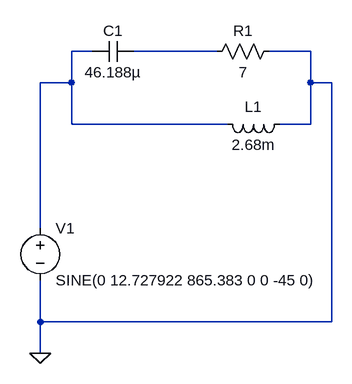
[diagram p0: schematic scheme9.asc]
scheme9.asc, the LTspice schematic file:
Version 4
SHEET 1 880 680
WIRE 256 -96 224 -96
WIRE 448 -96 320 -96
WIRE 592 -96 528 -96
WIRE 224 -48 224 -96
WIRE 224 -48 176 -48
WIRE 592 -48 592 -96
WIRE 624 -48 592 -48
WIRE 224 16 224 -48
WIRE 464 16 224 16
WIRE 592 16 592 -48
WIRE 592 16 544 16
WIRE 176 176 176 -48
WIRE 176 320 176 256
WIRE 624 320 624 -48
WIRE 624 320 176 320
WIRE 176 368 176 320
FLAG 176 368 0
SYMBOL voltage 176 160 R0
WINDOW 123 0 0 Left 0
WINDOW 39 0 0 Left 0
SYMATTR InstName V1
SYMATTR Value SINE(0 12.727922 865.383 0 0 -45 0)
SYMBOL ind 560 0 R90
WINDOW 0 5 56 VBottom 2
WINDOW 3 32 56 VTop 2
SYMATTR InstName L1
SYMATTR Value 2.68m
SYMBOL cap 320 -112 R90
WINDOW 0 0 32 VBottom 2
WINDOW 3 32 32 VTop 2
SYMATTR InstName C1
SYMATTR Value 46.188µ
SYMBOL res 544 -112 R90
WINDOW 0 0 56 VBottom 2
WINDOW 3 32 56 VTop 2
SYMATTR InstName R1
SYMATTR Value 7

The netlist it stands for:
* scheme9.asc
V1 N001 0 SINE(0 12.727922 865.383 0 0 -45 0)
L1 0 N001 2.68m
C1 N002 N001 46.188µ
R1 0 N002 7
.backanno
.end